# EAGLE schematic TOOLKIT_CON_ETIQ (EAGLE 7.6.0)
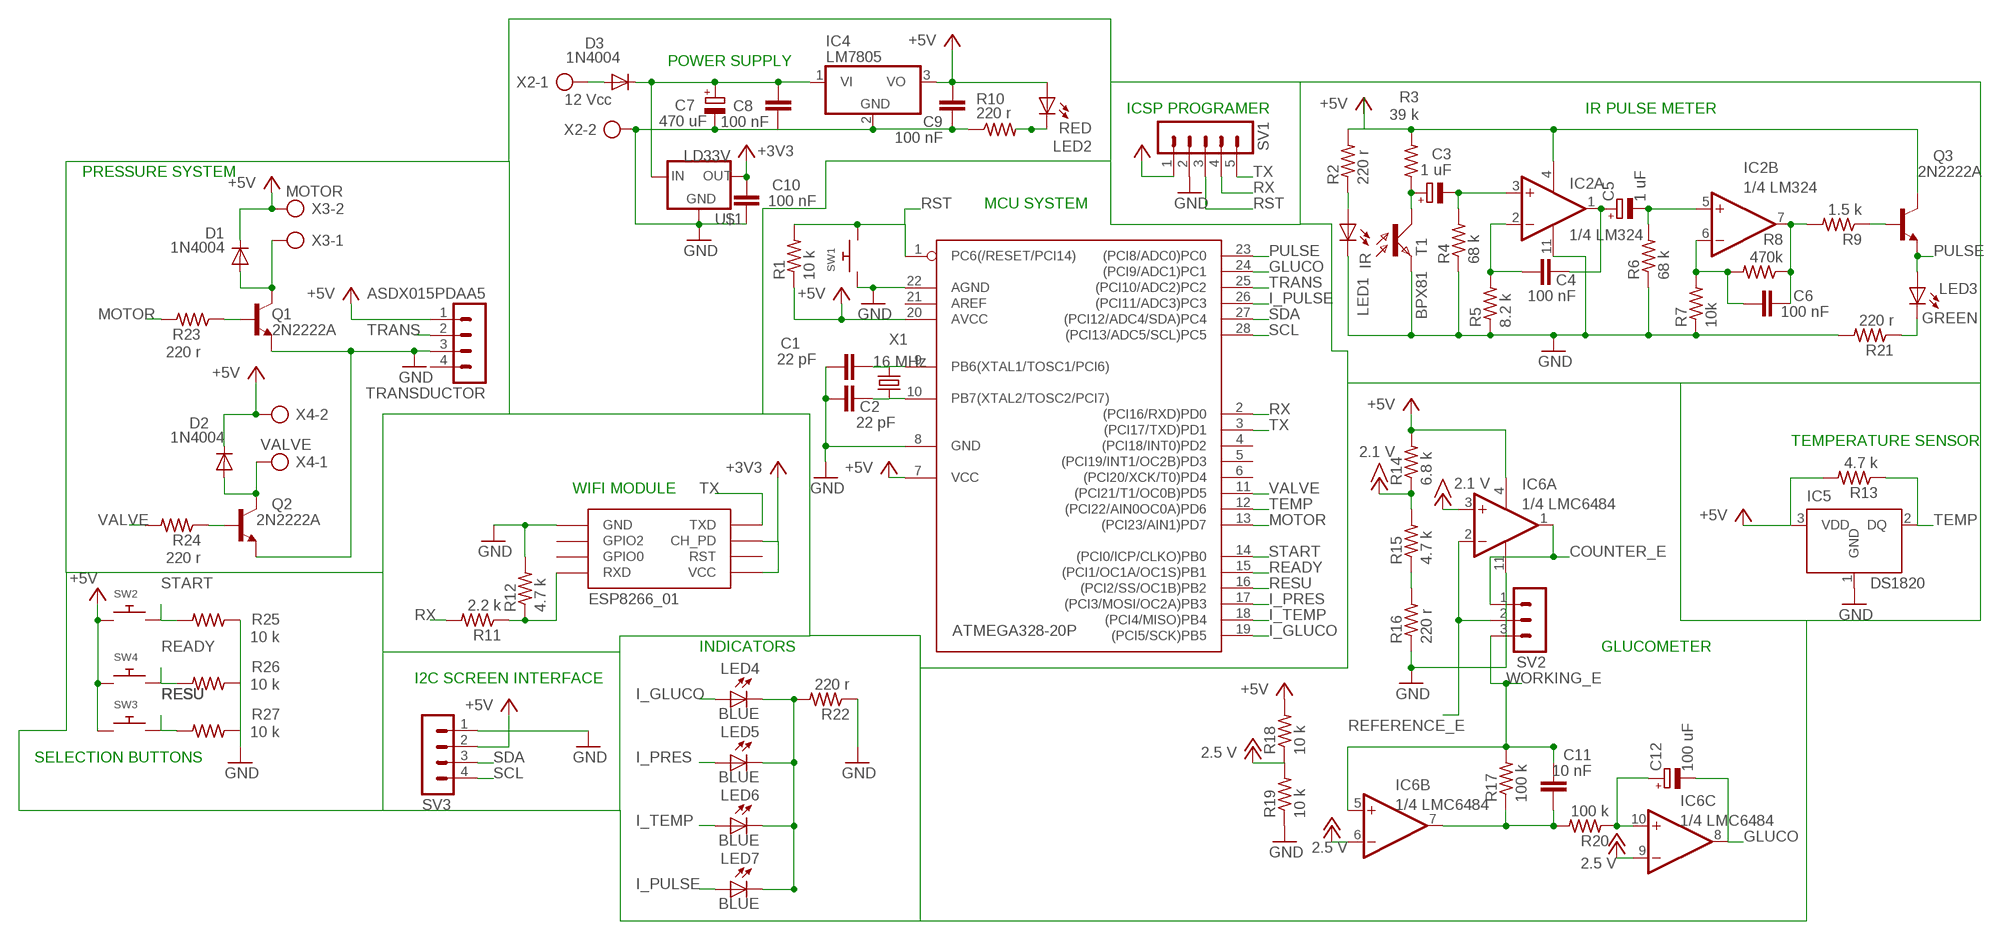
[diagram p0: schematic, sheet 1]

## Parts
C1  22 pF  C-EU050-024X044  [C050-024X044]
C2  22 pF  C-EU050-024X044  [C050-024X044]
C3  1 uF  CPOL-EUE2,5-6E  [E2,5-6E]
C4  100 nF  C-EU050-025X075  [C050-025X075]
C5  1 uF  CPOL-EUE2,5-6E  [E2,5-6E]
C6  100 nF  C-EU050-025X075  [C050-025X075]
C7  470 uF  CPOL-EUE2,5-6E  [E2,5-6E]
C8  100 nF  C-EU050-025X075  [C050-025X075]
C9  100 nF  C-EU050-025X075  [C050-025X075]
C10  100 nF  C-EU050-025X075  [C050-025X075]
C11  10 nF  C-EU050-025X075  [C050-025X075]
C12  100 uF  CPOL-EUE2,5-6E  [E2,5-6E]
D1  1N4004  [DO41-10]
D2  1N4004  [DO41-10]
D3  1N4004  [DO41-10]
IC1  ATMEGA328-20P  [DIL28-3]
IC2  1/4 LM324  LM324N  [DIL14]
IC4  LM7805  7805TV  [TO220V]
IC5  DS1820  [TO-92]
IC6  1/4 LMC6484  LM2902N  [DIL14]
LED1  IR  LED3MM  [LED3MM]
LED2  RED  LED3MM  [LED3MM]
LED3  GREEN  LED3MM  [LED3MM]
LED4  BLUE  LED3MM  [LED3MM]
LED5  BLUE  LED3MM  [LED3MM]
LED6  BLUE  LED3MM  [LED3MM]
LED7  BLUE  LED3MM  [LED3MM]
Q1  2N2222A  2N2222-NPN-TO92-EBC  [TO92-EBC]
Q2  2N2222A  2N2222-NPN-TO92-EBC  [TO92-EBC]
Q3  2N2222A  2N2222-NPN-TO92-EBC  [TO92-EBC]
R1  10 k  R-US_0207/10  [0207/10]
R2  220 r  R-US_0207/10  [0207/10]
R3  39 k  R-US_0207/10  [0207/10]
R4  68 k  R-US_0207/10  [0207/10]
R5  8.2 k  R-US_0207/10  [0207/10]
R6  68 k  R-US_0207/10  [0207/10]
R7  10k  R-US_0207/10  [0207/10]
R8  470k  R-US_0207/10  [0207/10]
R9  1.5 k  R-US_0207/10  [0207/10]
R10  220 r  R-US_0207/10  [0207/10]
R11  2.2 k  R-US_0207/10  [0207/10]
R12  4.7 k  R-US_0207/10  [0207/10]
R13  4.7 k  R-US_0207/10  [0207/10]
R14  6.8 k  R-US_0207/10  [0207/10]
R15  4.7 k  R-US_0207/10  [0207/10]
R16  220 r  R-US_0207/10  [0207/10]
R17  100 k  R-US_0207/10  [0207/10]
R18  10 k  R-US_0207/10  [0207/10]
R19  10 k  R-US_0207/10  [0207/10]
R20  100 k  R-US_0207/10  [0207/10]
R21  220 r  R-US_0207/10  [0207/10]
R22  220 r  R-US_0207/10  [0207/10]
R23  220 r  R-US_0207/10  [0207/10]
R24  220 r  R-US_0207/10  [0207/10]
R25  10 k  R-US_0207/10  [0207/10]
R26  10 k  R-US_0207/10  [0207/10]
R27  10 k  R-US_0207/10  [0207/10]
SV1  MA05-1  [MA05-1]
SV2  MA03-1  [MA03-1]
SV3  MA04-1  [MA04-1]
SW1  SWITCH_PUSHBUTTONEVQ-PE  [TACT_PANA-EVQ]
SW2  SWITCH_PUSHBUTTONEVQ-PE  [TACT_PANA-EVQ]
SW3  SWITCH_PUSHBUTTONEVQ-PE  [TACT_PANA-EVQ]
SW4  SWITCH_PUSHBUTTONEVQ-PE  [TACT_PANA-EVQ]
T1  BPX81  [BPX81]
TRANSDUCTOR  ASDX015PDAA5  MA04-1  [MA04-1]
U$1  LD33V  LD1117V33  [LD1117V33]
U$2  ESP8266_01  ESP01  [ESP01]
X1  16 MHz  CRYSTALHC18U-V  [HC18U-V]
X2  12 Vcc  AK500/2  [AK500/2]
X3  MOTOR  AK500/2  [AK500/2]
X4  VALVE  AK500/2  [AK500/2]

## Nets
+3V3: C10.2 U$1.OUT U$2.CH_PD U$2.VCC
+5V: C9.2 D1.C D2.C IC1.7(VCC) IC1.20(AVCC) IC2.4(P:V+) IC4.3(VO) IC5.3(VDD) IC6.4(P:V+) LED2.A Q3.C R1.1 R2.2 R3.2 R13.2 R14.2 R18.2 SV1.1 SV3.2 SW2.P$1 SW3.P$1 SW4.P$1 TRANSDUCTOR.1 X3.2 X4.2
+12V: IC6.6(B:-IN) IC6.9(C:-IN) R18.1 R19.2 ; supply symbol labelled 2.5 V
+15V: IC6.3(A:+IN) R14.1 R15.2 ; supply symbol labelled 2.1 V
COUNTER_E: IC6.1(A:OUT) SV2.1
GLUCO: C12.- IC1.24((PCI9/ADC1)PC1) IC6.8(C:OUT)
GND: C1.1 C2.1 C7.- C8.1 C9.1 C10.1 IC1.8(GND) IC1.22(AGND) IC2.11(P:V-) IC4.2(GND) IC5.1(GND) IC6.11(P:V-) LED1.K(C) Q1.E Q2.E R4.1 R5.1 R6.1 R7.1 R10.1 R12.2 R16.1 R19.1 R21.2 R22.1 R25.1 R26.1 R27.1 SV1.2 SV3.1 SW1.P$1 T1.E TRANSDUCTOR.3 U$1.GND U$2.GND X2.2
I_GLUCO: IC1.19((PCI5/SCK)PB5) LED4.A
I_PRES: IC1.17((PCI3/MOSI/OC2A)PB3) LED5.A
I_PULSE: IC1.26((PCI11/ADC3)PC3) LED7.A
I_TEMP: IC1.18((PCI4/MISO)PB4) LED6.A
MOTOR: IC1.13((PCI23/AIN1)PD7) R23.2
N$1: C1.2 IC1.9(PB6(XTAL1/TOSC1/PCI6)) X1.1
N$2: C2.2 IC1.10(PB7(XTAL2/TOSC2/PCI7)) X1.2
N$3: R11.1 R12.1 U$2.RX(RXD)
N$4: LED1.A R2.1
N$5: C3.+ R3.1 T1.C
N$6: C3.- IC2.3(A:+IN) R4.2
N$7: C4.1 IC2.2(A:-IN) R5.2
N$8: C6.1 IC2.6(B:-IN) R7.2 R8.2
N$9: C6.2 IC2.7(B:OUT) R8.1 R9.2
N$10: C4.2 C5.+ IC2.1(A:OUT)
N$11: C5.- IC2.5(B:+IN) R6.2
N$12: Q3.B R9.1
N$13: R15.1 R16.2
N$14: LED3.K(C) R21.1
N$16: C7.+ C8.2 D3.C IC4.1(VI) U$1.IN
N$17: LED2.K(C) R10.2
N$18: LED4.K(C) LED5.K(C) LED6.K(C) LED7.K(C) R22.2
N$19: C11.1 IC6.7(B:OUT) R17.1 R20.2
N$20: Q1.B R23.1
N$21: C12.+ IC6.10(C:+IN) R20.1
N$22: D2.A Q2.C X4.1
N$23: D1.A Q1.C X3.1
N$24: Q2.B R24.1
N$26: D3.A X2.1
PULSE: IC1.23((PCI8/ADC0)PC0) LED3.A Q3.E
READY: IC1.15((PCI1/OC1A/OC1S)PB1) R26.2 SW4.P$2
REFERENCE_E: IC6.2(A:-IN) SV2.2
RESU: IC1.16((PCI2/SS/OC1B)PB2) R27.2 SW3.P$2
RST: IC1.1(PC6(/RESET/PCI14)) R1.2 SV1.3 SW1.P$2
RX: IC1.2((PCI16/RXD)PD0) R11.2 SV1.4
SCL: IC1.28((PCI13/ADC5/SCL)PC5) SV3.4
SDA: IC1.27((PCI12/ADC4/SDA)PC4) SV3.3
START: IC1.14((PCI0/ICP/CLKO)PB0) R25.2 SW2.P$2
TEMP: IC1.12((PCI22/AIN0OC0A)PD6) IC5.2(DQ) R13.1
TRANS: IC1.25((PCI10/ADC2)PC2) TRANSDUCTOR.2
TX: IC1.3((PCI17/TXD)PD1) SV1.5 U$2.TX(TXD)
VALVE: IC1.11((PCI21/T1/OC0B)PD5) R24.2
WORKING_E: C11.2 IC6.5(B:+IN) R17.2 SV2.3
Unconnected: IC1.4((PCI18/INT0)PD2) IC1.5((PCI19/INT1/OC2B)PD3) IC1.6((PCI20/XCK/T0)PD4) IC1.21(AREF) IC2.8(C:OUT) IC2.9(C:-IN) IC2.10(C:+IN) IC2.12(D:+IN) IC2.13(D:-IN) IC2.14(D:OUT) IC6.12(D:+IN) IC6.13(D:-IN) IC6.14(D:OUT) TRANSDUCTOR.4 U$2.GPIO0 U$2.GPIO2 U$2.RST

## Notes on the sheet
- POWER SUPPLY
- ICSP PROGRAMER | IR PULSE METER
- PRESSURE SYSTEM
- MCU SYSTEM
- TEMPERATURE SENSOR
- WIFI MODULE
- INDICATORS | GLUCOMETER
- I2C SCREEN INTERFACE
- SELECTION BUTTONS

## Library data of the parts
C1 C2 C4 C6 C8-C11 = rcl:C-EU: CAPACITOR, European symbol
C3 C5 C7 C12 = rcl:CPOL-EU: POLARIZED CAPACITOR, European symbol
D1-D3 = diode:1N4004: DIODE general purpose rectifier, 1 A
IC1 = atmega328:ATMEGA328*P: MICROCONTROLLER 32 kBytes FLASH 2 kBytes SRAM 1 kBytes EEPROM USART 8-channel 10 bit ADC
IC2 = linear:LM324: OP AMP
IC4 = linear:78*: Positive VOLTAGE REGULATOR Source: http://cache.national.com/ds/LM/LM78L05.pdf http://www.fairchildsemi.com/ds/LM/LM7805.pdf
IC5 = DS1820:DS1820: DS1820 - 1-Wire Digital Thermometer
IC6 = linear:LM2902: Low power quad operational amplifier Source: Data sgeet <http://www.st.com/internet/com/TECHNICAL_RESOURCES/TECHNICAL_LITERATURE/DATASHEET/CD00000533.pdf>
LED1-LED7 = adafruit:LED: LED OSRAM: - CHIPLED LG R971, LG N971, LY N971, LG Q971, LY Q971, LO R971, LY R971 LH N974, LH R974 LS Q976, LO Q976, LY Q976 LO Q996 - Hyper CHIPLED LW Q18S LB Q993, LB Q99A, LB R99A - SideLED LS A670, LO A670, LY A670, LG A670, LP A670 LB A673, LV A673, LT A673, LW A673 LH A674 LY A675 LS A676, LA A676, LO A676, LY A676, LW A676 LS A679, LY A679, LG A679 - Hyper Micro SIDELED® LS Y876, LA Y876, LO Y876, LY Y876 LT Y87S - SmartLED LW L88C, LW L88S LB L89C, LB L89S, LG L890 LS L89K, LO L89K, LY L89K LS L896, LA L896, LO L896, LY L896 - TOPLED LS T670, LO T670, LY T670, LG T670, LP T670 LSG T670, LSP T670, LSY T670, LOP T670, LYG T670 LG T671, LOG T671, LSG T671 LB T673, LV T673, LT T673, LW T673 LH T674 LS T676, LA T676, LO T676, LY T676, LB T676, LH T676, LSB T676, LW T676 LB T67C, LV T67C, LT T67C, LS T67K, LO T67K, LY T67K, LW E67C LS E67B, LA E67B, LO E67B, LY E67B, LB E67C, LV E67C, LT E67C LW T67C LS T679, LY T679, LG T679 LS T770, LO T770, LY T770, LG T770, LP T770 LB T773, LV T773, LT T773, LW T773 LH T774 LS E675, LA E675, LY E675, LS T675 LS T776, LA T776, LO T776, LY T776, LB T776 LHGB T686 LT T68C, LB T68C - Hyper Mini TOPLED® LB M676 - Mini TOPLED Santana® LG M470 LS M47K, LO M47K, LY M47K Source: http://www.osram.convergy.de/
Q1-Q3 = transistor-neu-to92:*-NPN-: NPN Transistror
R1-R27 = rcl:R-US_: RESISTOR, American symbol
SV1 = con-lstb:MA05-1: PIN HEADER; OC_FARNELL: unknown; OC_NEWARK: unknown
SV2 = con-lstb:MA03-1: PIN HEADER; OC_FARNELL: unknown; OC_NEWARK: unknown
SV3 TRANSDUCTOR = con-lstb:MA04-1: PIN HEADER; OC_FARNELL: unknown; OC_NEWARK: unknown
SW1-SW4 = adafruit:SWITCH_PUSHBUTTON: Buttons SOFTTOUCHSMD_SJ - Soft touch temporary push button (Super Junk Akihabara) Compatible with SKPMANE010 [Mouser: 688-SKPMAN] C&K_KSS = Digikey: KSS221GLFS
T1 = opto-trans-siemens:BPX81: PHOTO TRANSISTOR; OC_FARNELL: unknown; OC_NEWARK: unknown
U$1 = LD1117V33:LD1117V33
U$2 = esp8266modules:ESP01: ESP8266 Wifi module 01
X1 = crystal:CRYSTAL: CRYSTAL; OC_FARNELL: unknown; OC_NEWARK: unknown
X2-X4 = con-ptr500:AK500/2: CONNECTOR; OC_FARNELL: unknown; OC_NEWARK: unknown